# Altium schematic sheet Control_Pilot_Schem.SchDoc
size A; SheetNumber: 4; SheetTotal: 8
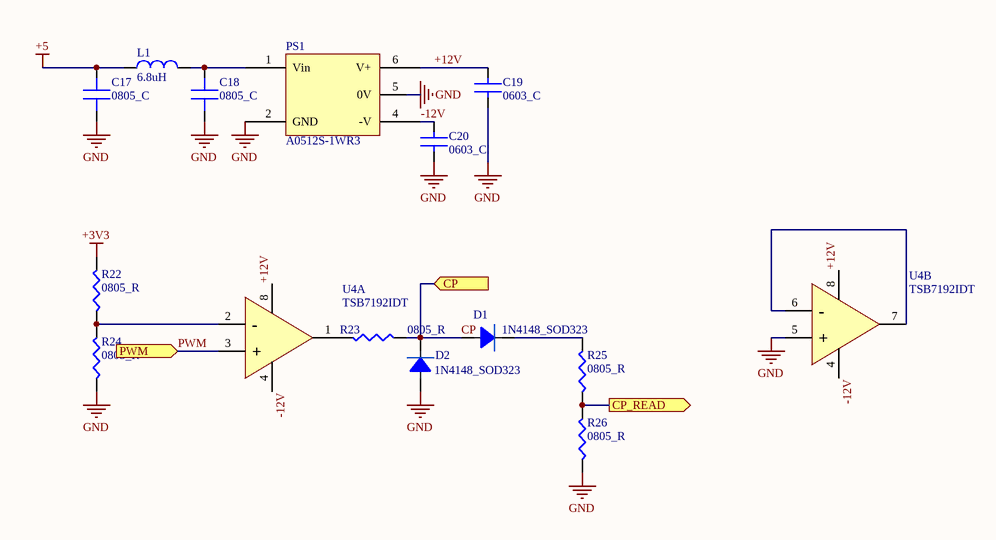
[diagram p0: Control_Pilot_Schem.SchDoc]

## Parts
C17  0805_C  [C0805 - 0.1uf]
C18  0805_C  [C0805 - 0.1uf]
C19  0603_C  [0603_CAP]
C20  0603_C  [0603_CAP]
D1  1N4148_SOD323  [SOD-323]
D2  1N4148_SOD323  [SOD-323]
L1  6.8uH  [R0805]
PS1  A0512S-1WR3  [CONV_RB-0512D/HP]
R22  0805_R  [R0805]
R23  0805_R  [R0805]
R24  0805_R  [R0805]
R25  0805_R  [R0805]
R26  0805_R  [R0805]
U4  TSB7192IDT  [SOP8]  (parts A,B of 2)

## Ports
CP (in), CP_READ (out), PWM (in)

## Nets
+3V3: R22.2
+5: C17.2 L1.1
GND: C17.1 C18.1 C19.2 C20.2 D2.A(Anode) PS1.2(GND) PS1.5(0V) R24.1 R26.1 U4.5(+)
+12V: C19.1 PS1.6(V+) U4.8(VCC)
-12V: C20.1 PS1.4(-V) U4.4(VSS)
CP: D1.A(Anode) D2.K(Cathode) R23.1 ; port CP
CP_READ: R25.1 R26.2 ; port CP_READ
PWM: U4.3(+) ; port PWM
NetC18_2: C18.2 L1.2 PS1.1(Vin)
NetD1_K: D1.K(Cathode) R25.2
NetR22_1: R22.1 R24.2 U4.2(-)
NetR23_2: R23.2 U4.1(OUT1)
NetU4_6: U4.6(-) U4.7(OUT1)

## Library data of the parts
C17 C18 = 0805 Capacitor
C19 C20 = 0603 Capacitor
D1 D2 = 1N4148WS: DIODE GEN PURP 100V 300MA SOD123; Reverse Recovery Time: 4ns; Forward Voltage: 1.25V; Element Configuration: Single; Forward Current: 150mA; Peak Non-Repetitive Surge Current: 2A; Max Reverse Current: 1uA; Power Dissipation: 400mW; Polarity: Standard; Capacitance: 2pF; Voltage Rating (DC): 75V; Supplier 1: Digi-Key; Stock 1: 0; Pricing 1: 1=0.18000, 10=0.16800, 100=0.09120, 500=0.05614, 1000=0.03828 (USD); RoHS: Yes; Mount: Surface Mount; Number of Pins: 2; Weight: 0.000353oz; Contact Plating: Tin,Matte; Min Operating Temperature: -65°C; Max Operating Temperature: 150°C; Packaging: Tape and Reel; Max Repetitive Reverse Voltage (Vrrm): 100V; Average Rectified Current: 300mA; Max Reverse Voltage (DC): 100V; Package Quantity: 3000; Recovery Time: 4ns; Max Forward Surge Current (Ifsm): 2A; Current Rating: 150mA; Max Surge Current: 2A; Output Current: 150mA; Series: -; Voltage: 100V; Reverse Recovery Time-Max: 4ns; Power Rating: 400mW; Length: 2.85mm; Width: 1.7mm; Height: 1.25mm; Radiation Hardening: No; Lead Free: Lead Free; RoHS Compliant: Yes; REACH SVHC: No SVHC; ComponentLink1URL: https://datasheet.ciiva.com/911/ds30086-911734.pdf?src-supplier=Digi-Key; ComponentLink1Description: https://datasheet.ciiva.com/911/ds30086-911734.pdf?src-supplier=Digi-Key; ComponentLink2URL: https://datasheet.ciiva.com/911/ds30086-911735.pdf?src-supplier=Digi-Key; ComponentLink2Description: https://datasheet.ciiva.com/911/ds30086-911735.pdf?src-supplier=Digi-Key; ComponentLink3URL: https://datasheet.ciiva.com/22695/1915529-22695239.pdf?src-supplier=Element14; ComponentLink3Description: https://datasheet.ciiva.com/22695/1915529-22695239.pdf?src-supplier=Element14; ComponentLink4URL: https://datasheet.ciiva.com/911/ds30086-911736.pdf?src-supplier=Digi-Key; ComponentLink4Description: https://datasheet.ciiva.com/911/ds30086-911736.pdf?src-supplier=Digi-Key; ComponentLink5URL: https://datasheet.ciiva.com/1179/1915529-1179304.pdf?src-supplier=Element14; ComponentLink5Description: https://datasheet.ciiva.com/1179/1915529-1179304.pdf?src-supplier=Element14; ComponentLink6URL: https://datasheet.ciiva.com/4435/ds30086-4435128.pdf?src-supplier=Mouser; ComponentLink6Description: https://datasheet.ciiva.com/4435/ds30086-4435128.pdf?src-supplier=Mouser; ComponentLink7URL: https://datasheet.ciiva.com/8300/ds30086-8300392.pdf?src-supplier=Avnet; ComponentLink7Description: https://datasheet.ciiva.com/8300/ds30086-8300392.pdf?src-supplier=Avnet; ComponentLink8URL: https://datasheet.ciiva.com/25919/ds30086-25919609.pdf?src-supplier=Avnet+Europe; ComponentLink8Description: https://datasheet.ciiva.com/25919/ds30086-25919609.pdf?src-supplier=Avnet+Europe; ComponentLink9URL: https://datasheet.ciiva.com/15219/getdatasheetpartid-110030-15219548.pdf?src-supplier=Verical; ComponentLink9Description: https://datasheet.ciiva.com/15219/getdatasheetpartid-110030-15219548.pdf?src-supplier=Verical; ComponentLink10URL: https://datasheet.ciiva.com/8303/ds30086-8303197.pdf?src-supplier=Avnet; ComponentLink10Description: https://datasheet.ciiva.com/8303/ds30086-8303197.pdf?src-supplier=Avnet
L1 = ILSB1206ER100K: 6.8uH 0805 Inductor; Manufacturer 1: Vishay Dale; Core Material: Ferrite; Current Rating: 25mA; Tolerance: 10%; Shielding: Shielded; Self Resonant Frequency: 28MHz; Q Factor: 45; Inductance: 10uH; DC Resistance (DCR): 1R; Test Frequency: 2MHz; Supplier 1: Mouser; Stock 1: 11113; Pricing 1: 1=0.23, 10=0.204, 50=0.204, 100=0.137, 1000=0.096, 10000=0.072 (USD); RoHS: Yes; Mount: Surface Mount; Case/Package: 1206; Case Code (Metric): 3216; Case Code (Imperial): 1206; Min Operating Temperature: -55°C; Max Operating Temperature: 125°C; Package Quantity: 3000; Packaging: Tape and Reel; Inductance Tolerance: 10%; Max DC Current: 25mA; Termination: SMD/SMT; DC Current: 25mA; Series: ILSB-1206; Rated Current-Max: 25mA; Length: 0.126inch; Width: 0.063inch; Height: 0.02inch; Height - Seated (Max): 0.055inch; Depth: 1.8mm; Radiation Hardening: No; Military Standard: Not; Lead Free: Lead Free; RoHS Compliant: Yes; Reach SVHC Compliant: Unknown; ComponentLink1URL: https://datasheet.ciiva.com/1067/ilsb1206-1067856.pdf?src-supplier=Digi-Key; ComponentLink1Description: https://datasheet.ciiva.com/1067/ilsb1206-1067856.pdf?src-supplier=Digi-Key; ComponentLink2URL: https://datasheet.ciiva.com/7243/1537078-7243341.pdf?src-supplier=Newark; ComponentLink2Description: https://datasheet.ciiva.com/7243/1537078-7243341.pdf?src-supplier=Newark; ComponentLink3URL: https://datasheet.ciiva.com/3867/ilsb1206-3867119.pdf?src-supplier=Arrow+Electronics; ComponentLink3Description: https://datasheet.ciiva.com/3867/ilsb1206-3867119.pdf?src-supplier=Arrow+Electronics; Supplier Part Number 1: 70-ILSB1206ER100K; Manufacturer Part Number 1: ILSB1206ER100K
R22-R26 = 0805 Resistor
U4 = TSB7192IDT: 22MHz 300nA Dual channel SOIC-8 Precision Op Amps ROHS